# EAGLE schematic H0AR9 (EAGLE 9.6.2)

## Sheet 1 of 2
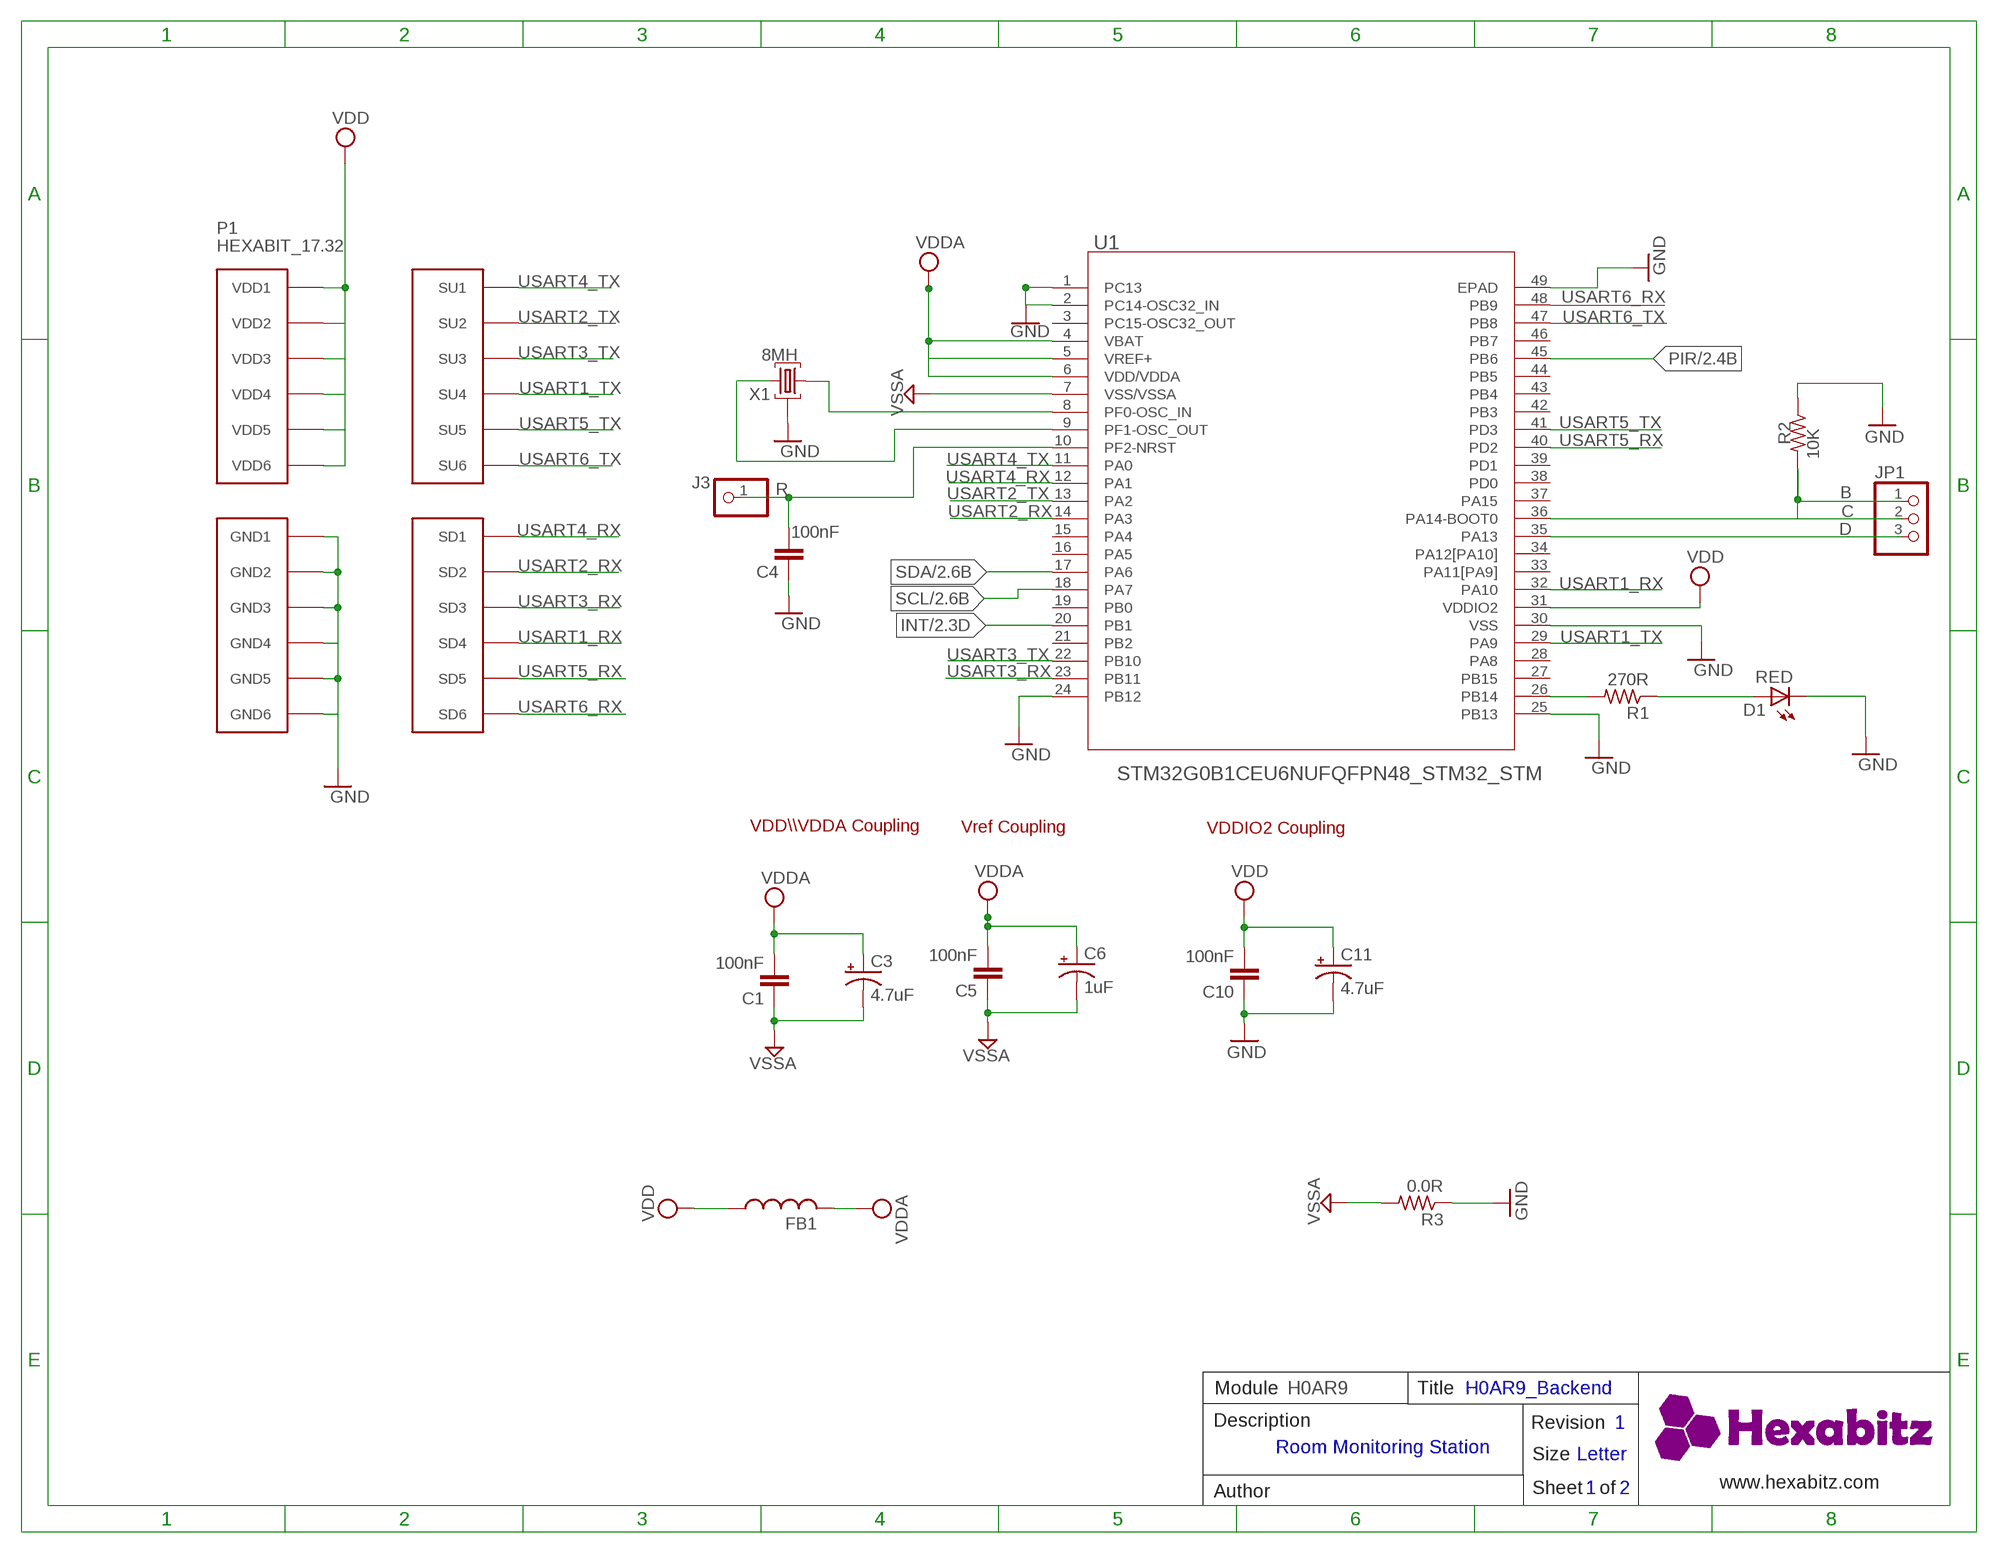
[diagram p0: schematic, sheet 1]

### Parts
C1  100nF  C-0603  [C-0603]
C3  4.7uF  C-0805-POL  [C-0805-POL]
C4  100nF  C-0603  [C-0603]
C5  100nF  C-0603  [C-0603]
C6  1uF  C-0805-POL  [C-0805-POL]
C10  100nF  C-0603  [C-0603]
C11  4.7uF  C-0805-POL  [C-0805-POL]
D1  RED  VLMS1300-GS08  [VLMS1300-GS08]
FB1  FB-TDK_MMZ1608Y300B  [FB-TDK_MMZ1608Y300B]
J3  PINHD-1X1  [1X01]
JP1  PINHD-1X3  [1X03]
P1  HEXABIT_17.32  [HEXABIT_17.32]
R1  270R  R-0603  [R-0603]
R2  10K  R-0603  [R-0603]
R3  0.0R  R-0603  [R-0603]
U1  STM32G0B1CEU6NUFQFPN48_STM32_STM  [UFQFPN48_STM32_STM]
X1  8MH  XTALL_CSTCE8M00G52  [XTALL_CSTCE8M00G52]

### Nets
C: JP1.1 JP1.2 R2.2 U1.36(PA14-BOOT0)
D: JP1.3 U1.35(PA13)
GND: C4.1 C10.1 C11.2(-) D1.C P1.PAD_PD7(GND1) P1.PAD_PD8(GND2) P1.PAD_PD9(GND3) P1.PAD_PD10(GND4) P1.PAD_PD11(GND5) P1.PAD_PD12(GND6) R2.1 R3.1 U1.1(PC13) U1.2(PC14-OSC32_IN) U1.24(PB12) U1.25(PB13) U1.30(VSS) U1.49(EPAD) X1.P$2 ; also sheet 2
GND1: C1.1 C3.2(-) C5.1 C6.2(-) R3.2 U1.7(VSS/VSSA) ; supply symbol labelled VSSA
INT: U1.20(PB1) ; also sheet 2
N$1: U1.8(PF0-OSC_IN) X1.P$3
N$2: U1.9(PF1-OSC_OUT) X1.P$1
N$17: R1.2 U1.26(PB14)
N$19: D1.A R1.1
PIR: U1.45(PB6) ; also sheet 2
R: C4.2 J3.1 U1.10(PF2-NRST)
SCL: U1.18(PA7) ; also sheet 2
SDA: U1.17(PA6) ; also sheet 2
USART1_RX: P1.PAD_PD4(SD4) U1.32(PA10)
USART1_TX: P1.PAD_PU4(SU4) U1.29(PA9)
USART2_RX: P1.PAD_PD2(SD2) U1.14(PA3)
USART2_TX: P1.PAD_PU2(SU2) U1.13(PA2)
USART3_RX: P1.PAD_PD3(SD3) U1.23(PB11)
USART3_TX: P1.PAD_PU3(SU3) U1.22(PB10)
USART4_RX: P1.PAD_PD1(SD1) U1.12(PA1)
USART4_TX: P1.PAD_PU1(SU1) U1.11(PA0)
USART5_RX: P1.PAD_PD5(SD5) U1.40(PD2)
USART5_TX: P1.PAD_PU5(SU5) U1.41(PD3)
USART6_RX: P1.PAD_PD6(SD6) U1.48(PB9)
USART6_TX: P1.PAD_PU6(SU6) U1.47(PB8)
VCC: C1.2 C3.1(+) C5.2 C6.1(+) FB1.2 U1.4(VBAT) U1.5(VREF+) U1.6(VDD/VDDA) ; supply symbol labelled VDDA
VDD: C10.2 C11.1(+) FB1.1 P1.PAD_PU7(VDD1) P1.PAD_PU8(VDD2) P1.PAD_PU9(VDD3) P1.PAD_PU10(VDD4) P1.PAD_PU11(VDD5) P1.PAD_PU12(VDD6) U1.31(VDDIO2) ; also sheet 2
Unconnected: U1.3(PC15-OSC32_OUT) U1.15(PA4) U1.16(PA5) U1.19(PB0) U1.21(PB2) U1.27(PB15) U1.28(PA8) U1.33(PA11[PA9]) U1.34(PA12[PA10]) U1.37(PA15) U1.38(PD0) U1.39(PD1) U1.42(PB3) U1.43(PB4) U1.44(PB5) U1.46(PB7)

### Notes on the sheet
- R | B
- VDD\\\VDDA Coupling | Vref Coupling | VDDIO2 Coupling
- Module | H0AR9 | Title | H0AR9_Backend
- Description | Revision | 1
- Room Monitoring Station
- Size | Letter
- www.hexabitz.com
- Author | Sheet   of | 1 | 2
- C:/Users/Admin/Desktop/logodraft.bmp

## Sheet 2 of 2
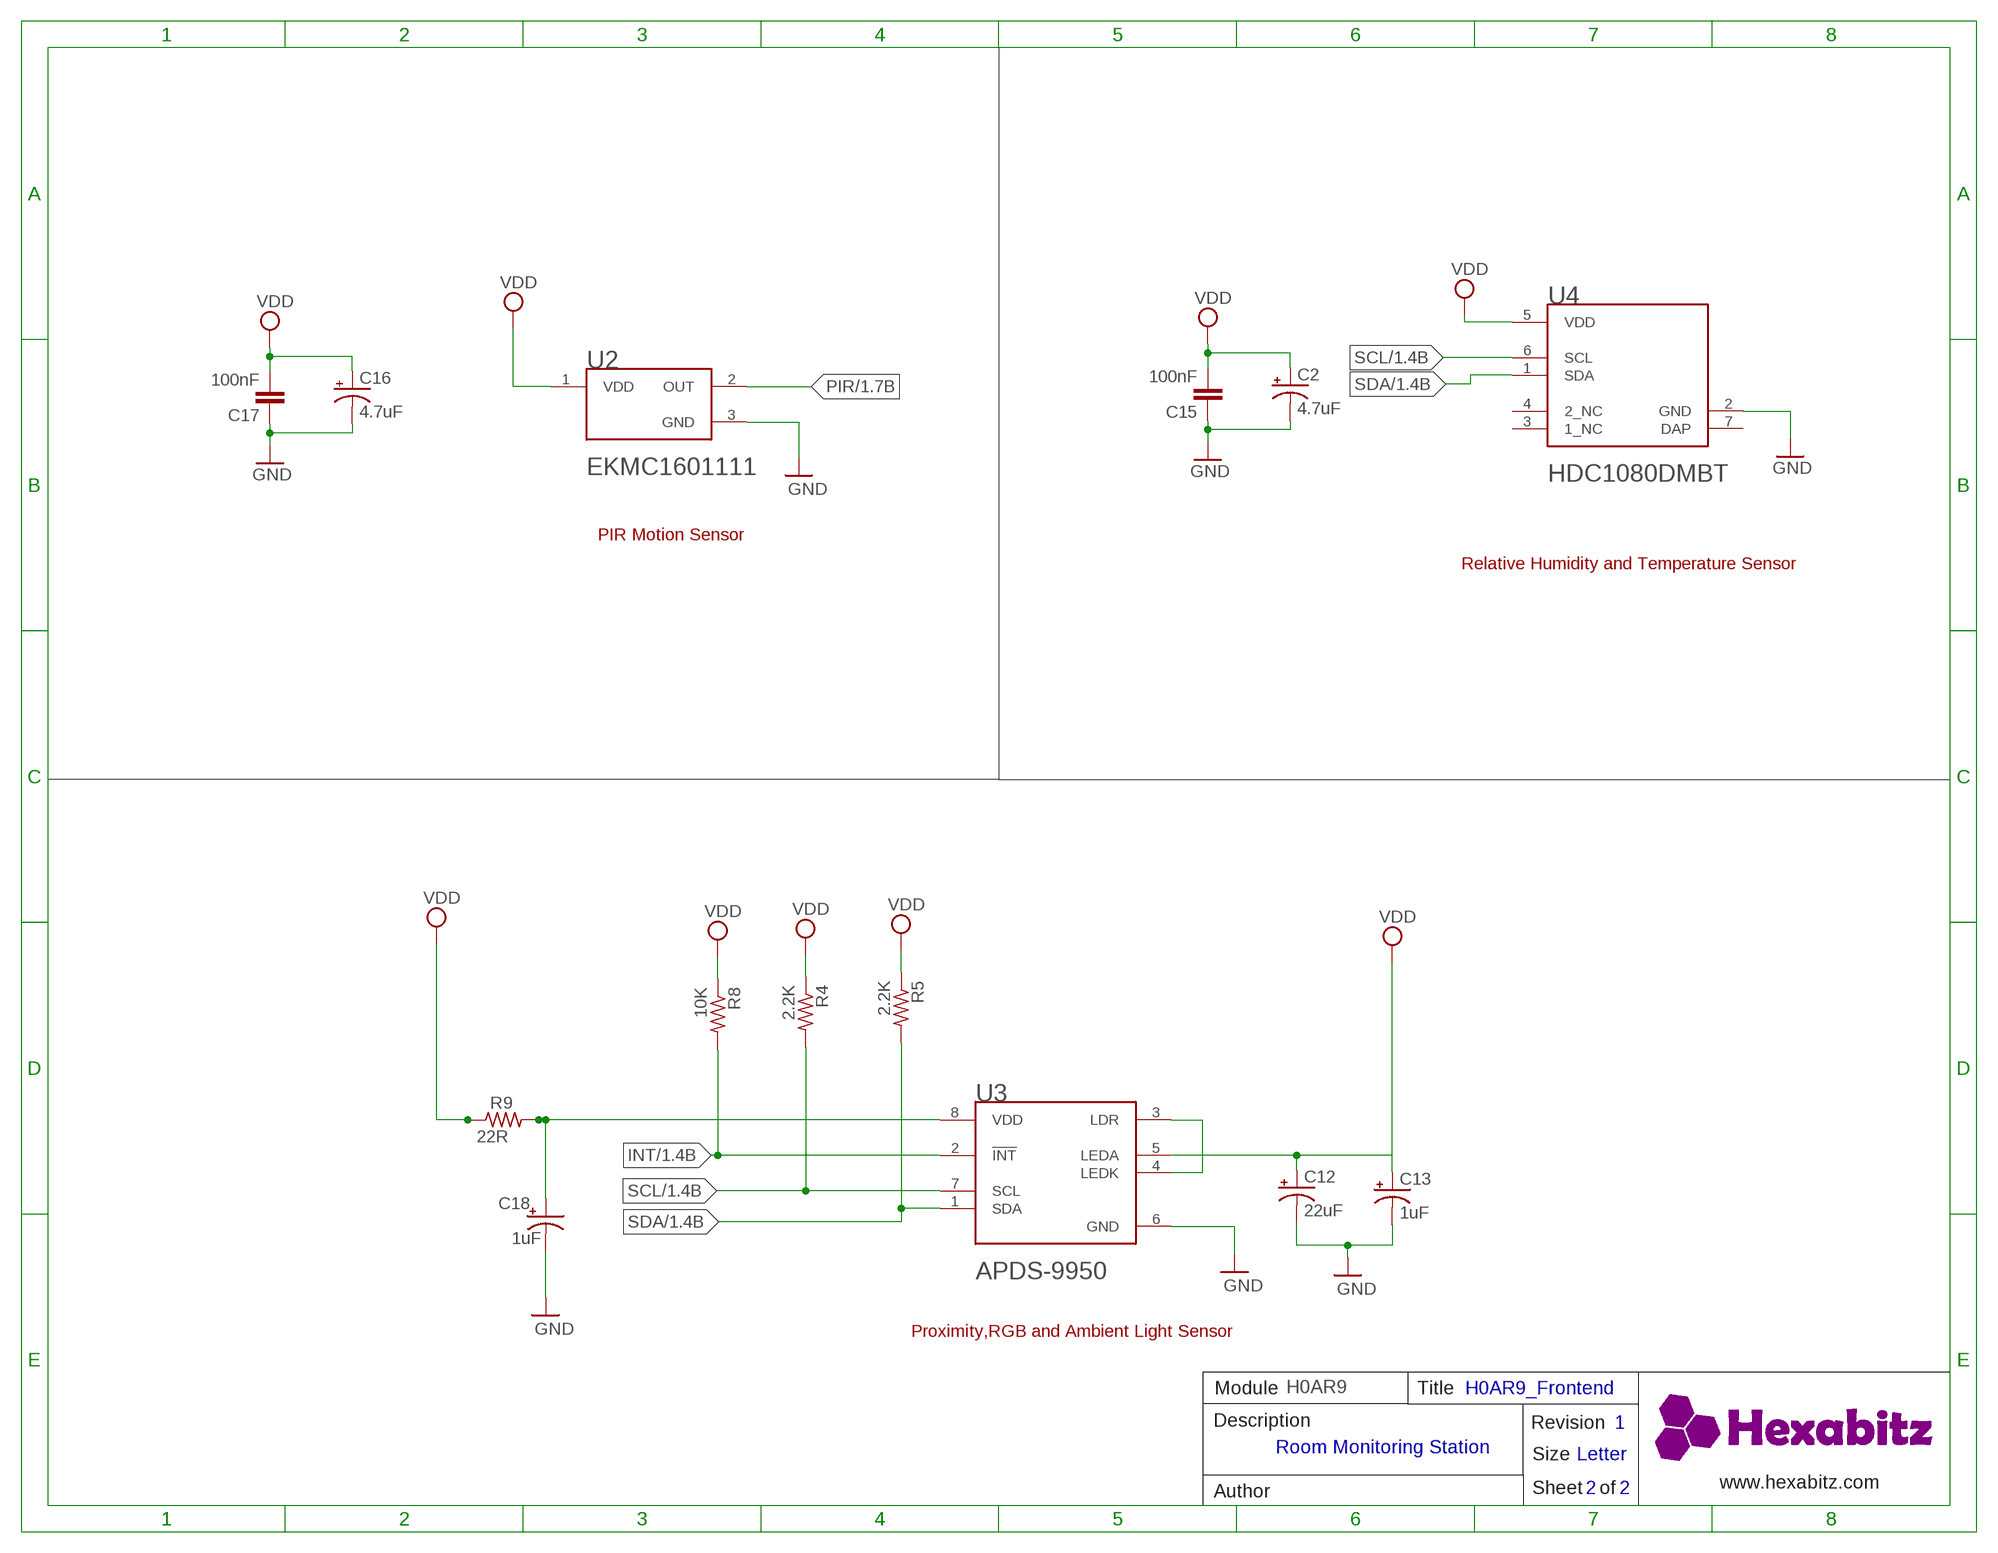
[diagram p1: schematic, sheet 2]

### Parts
C2  4.7uF  C-0805-POL  [C-0805-POL]
C12  22uF  C-0805-POL  [C-0805-POL]
C13  1uF  C-0805-POL  [C-0805-POL]
C15  100nF  C-0603  [C-0603]
C16  4.7uF  C-0805-POL  [C-0805-POL]
C17  100nF  C-0603  [C-0603]
C18  1uF  C-0805-POL  [C-0805-POL]
R4  2.2K  R-0603  [R-0603]
R5  2.2K  R-0603  [R-0603]
R8  10K  R-0603  [R-0603]
R9  22R  R-US_R1210  [R1210]
U2  PANASONIC_EKMC1601111PANASONIC_EKMC1601111_0_0  [PANASONIC_EKMC1601111_0]
U3  BROADCOM_APDS-9950BROADCOM_APDS-9950_0_0  BROADCOM_APDS-9960BROADCOM_APDS-9960_0_0  [BROADCOM_APDS-9960_0]
U4  TEXAS_INSTRUMENTS_HDC1080DMBT1TEXAS_INSTRUMENTS_HDC1080DMBT_0_1  [TEXAS_INSTRUMENTS_HDC1080DMBT_1]

### Nets
GND: C2.2(-) C12.2(-) C13.2(-) C15.1 C16.2(-) C17.1 C18.2(-) U2.3(GND) U3.6(GND) U4.2(GND) ; also sheet 1
INT: R8.2 U3.2(!INT!) ; also sheet 1
N$3: U3.3(LDR) U3.4(LEDK)
N$5: C18.1(+) R9.2 U3.8(VDD)
PIR: U2.2(OUT) ; also sheet 1
SCL: R4.2 U3.7(SCL) U4.6(SCL) ; also sheet 1
SDA: R5.2 U3.1(SDA) U4.1(SDA) ; also sheet 1
VDD: C2.1(+) C12.1(+) C13.1(+) C15.2 C16.1(+) C17.2 R4.1 R5.1 R8.1 R9.1 U2.1(VDD) U3.5(LEDA) U4.5(VDD) ; also sheet 1
Unconnected: U4.3(1_NC) U4.4(2_NC)

### Notes on the sheet
- PIR Motion Sensor
- Relative Humidity and Temperature Sensor
- Proximity,RGB and Ambient Light Sensor
- Module | H0AR9 | Title | H0AR9_Frontend
- Description | Revision | 1
- Room Monitoring Station
- Size | Letter
- www.hexabitz.com
- Author | Sheet   of | 2 | 2

## Power pins joined to a net without a drawn wire
DAP: U4.7(DAP)

## Library data of the parts
C1 C4 C5 C10 C15 C17 = HEXABITZ_RCLS:C-0603: CAP CER 10% X7R 0603; CAPACITANCE: 100nF; MFN: AVX CORPORATION; MPN: '0603YC104K4T2A; OCTOPART_URL: 'https://octopart.com/0603yc104k4t2a-avx+interconnect+%2F+elco-8120651; TOLERANCE: 10%; VOLTAGE_RATING: 16.0 V
C2 C3 C16 = HEXABITZ_RCLS:C-0805-POL: Cap Tant Solid SMD 2012; CAPACITANCE: 4.7uF; MFN: Panasonic; MPN: 10TPU4R7MSI; OCTOPART_URL: https://octopart.com/10tpu4r7msi-panasonic-29487748; TOLERANCE: 20%; VOLTAGE_RATING: 10.0 V
C6 C13 C18 = HEXABITZ_RCLS:C-0805-POL: Cap Tant Solid SMD 2012; CAPACITANCE: 1uF; MFN: 'YAGEO [VA]; MPN: 'CC0805KKX7R7BB105; OCTOPART_URL: https://octopart.com/cc0805kkx7r7bb105-yageo-8376555?r=sp; TOLERANCE: 20%; VOLTAGE_RATING: 10.0 V
C11 = HEXABITZ_RCLS:C-0805-POL: Cap Tant Solid SMD 2012; CAPACITANCE: 1.00uF; MFN: 'Panasonic; MPN: '10TPU4R7MSI; OCTOPART_URL: 'https://octopart.com/10tpu4r7msi-panasonic-29487748?r=sp; TOLERANCE: 10%; VOLTAGE_RATING: 16.0 V
C12 = HEXABITZ_RCLS:C-0805-POL: Cap Tant Solid SMD 2012; CAPACITANCE: 22uF; MFN: Kemet; MPN: T491B226K01AT; OCTOPART_URL: https://octopart.com/t491b226k016at-kemet-96457?r=sp; TOLERANCE: 20%; VOLTAGE_RATING: 10.0 V
D1 = HEXABITZ_USER_INTERFACE_PARTS:VLMS1300-GS08: Red 0603 130° Clear 54 mcd 2 V Surface Mount ChipLED ; Octopart Url : http://octopart.com/vlms1300-gs08-vishay-21709201; MFN: Vishay; MPN: VLMS1300-GS08; OCTOPART_URL: https://octopart.com/vlms1300-gs08-vishay-21709201?r=sp&s=0nXJNjGsSbWwqfqWlZv0EA
FB1 = HEXABITZ_RCLS:FB-TDK_MMZ1608Y300B: Ferrite Beads Multi-Layer 30Ohm 25% 100MHz 1.5A 50mOhm DCR 0603; MFN: TDK; MPN: MMZ1608Y300BTA00; OCTOPART_URL: https://octopart.com/mmz1608y300bta00-tdk-7906990?r=sp
J3 = HEXABITZ_USER_INTERFACE_PARTS:PINHD-1X1: PIN HEADER; MFN: TE Connectivity; MPN: 87227-1; OCTOPART_URL: https://octopart.com/87227-1-te+connectivity-39512052?r=sp
JP1 = pinhead:PINHD-1X3: PIN HEADER
P1 = hexabitz_connectors:HEXABIT_?: Hexabitz Hexagon Module Connector Hexagon side length = 28.87mm.
R1 = HEXABITZ_RCLS:R-0603: Thick Film Resistors - SMD 0603; MFN: 'Panasonic; MPN: 'ERJ-3GEYJ271V; OCTOPART_URL: https://octopart.com/erj-3geyj271v-panasonic-55560546?r=sp; RESISTANCE: 270R
R2 = HEXABITZ_RCLS:R-0603: Thick Film Resistors - SMD 0603; MFN: Vishay; MPN: '060300J0103T5E; OCTOPART_URL: https://octopart.com/search?q=060300J0103T5E&currency=USD&specs=0; RESISTANCE: 10K
R3 = HEXABITZ_RCLS:R-0603: Thick Film Resistors - SMD 0603; MFN: YAGEO [VR]; MPN: RC0603JR-070RL; OCTOPART_URL: https://octopart.com/rc0603jr-070rl-yageo-1241539?r=sp; RESISTANCE: 0R
R4 R5 = HEXABITZ_RCLS:R-0603: Thick Film Resistors - SMD 0603; MFN: Yageo; MPN: RC0603FR-072K2L; OCTOPART_URL: https://octopart.com/rc0603fr-072k2l-yageo-1214512?r=sp; RESISTANCE: 2.2K Ohm; TOLERANCE: 5%
R8 = HEXABITZ_RCLS:R-0603: Thick Film Resistors - SMD 0603; MFN: Vishay; MPN: '060300J0103T5E; OCTOPART_URL: https://octopart.com/search?q=060300J0103T5E&currency=USD&specs=0; RESISTANCE: 10K Ohm; TOLERANCE: 5%
R9 = rcl:R-US_: RESISTOR, American symbol; SPICEPREFIX: R
U1 = HEXABITZ_ICs:STM32G0B1CEU6N; COPYRIGHT: Copyright (C) 2022 Ultra Librarian. All rights reserved.; MFN: STMicroelectronics; MPN: STM32G0B1CEU6N; OCTOPART_URL: https://octopart.com/stm32g0b1ceu6n-stmicroelectronics-116364672?r=sp
U2 = HEXABITZ_ICs:PANASONIC_EKMC1601111: Board Mount Motion & Position Sensors Digital 170uA 5m White; CENTROID_NOT_SPECIFIED: No; DATASHEET: https://upverter.com/datasheet/08257041b259bfb866b24d8a71eb3fd58ddfaa35.pdf; DIGIKEY_DESCRIPTION: IC SENSOR MOTION PIR 170UA DGTL WHT; DIGIKEY_PART_NUMBER: 255-3074-ND; IMPORTED_FROM: octopart; LEAD_FREE: yes; MF: Panasonic; MOUSER_PART_NUMBER: 769-EKMC1601111; MPN: EKMC1601111; NUM_PINS: 3; OCTOPART_PART_NUMBER: 95495d6204bb4a8e; PACKAGE: PTH_SENSOR_11MM_DIA; PREFIX: U; ROHS: yes; SENSOR_TYPE: Motion, Pyroelectric, PIR (Passive Infrared); TEMPERATURE_RANGE_HIGH: +60 °C; TEMPERATURE_RANGE_LOW: -20 °C; VOLTAGE: 3 V ~ 6 V
U3 = HEXABITZ_ICs:BROADCOM_APDS-9960: Optical Sensor Ambient 560nm I²C 8-SMD Module; AMBIENT_TEMPERATURE_RANGE_HIGH: +85°C; AMBIENT_TEMPERATURE_RANGE_LOW: -30°C; AUTOMOTIVE: No; CENTROID_NOT_SPECIFIED: No; DATASHEET: http://docs.avagotech.com/docs/AV02-4191EN; DEVICE_CLASS_L1: Sensors; DEVICE_CLASS_L2: Optical Sensors; DEVICE_CLASS_L3: unset; DIGIKEY_DESCRIPTION: SENSOR OPT 560NM AMBIENT MODULE; DIGIKEY_PART_NUMBER: 516-3480-1-ND; FOOTPRINT_VARIANT_NAME_0: Recommended_Land_Pattern; HEIGHT: 1.45mm; LEAD_FREE: Yes; MAX_SUPPLY_VOLTAGE: 3.6V; MF: Broadcom; MFG_PACKAGE_IDENT: 0; MFG_PACKAGE_IDENT_DATE: 0; MFG_PACKAGE_IDENT_REV: 0; MIN_SUPPLY_VOLTAGE: 2.4V; MOUSER_PART_NUMBER: 630-APDS-9960; MPN: APDS-9960; OPERATING_SUPPLY_CURRENT: 38-790uA; PACKAGE: SMD8; PIN_0_0_5_INSIDE_EDGE: clock; PREFIX: U; ROHS: Yes; SENSOR_OUTPUT: I2C; TEMPERATURE_RANGE_HIGH: +85°C; TEMPERATURE_RANGE_LOW: -30°C; VERIFICATION_VERSION: 0.0.0.3
U4 = HEXABITZ_ICs:TEXAS_INSTRUMENTS_HDC1080DMBT1: HDC1080 Low Power, High Accuracy Digital Humidity Sensor with Temperature Sensor; ACCURACY: 2%; AMBIENT_TEMPERATURE_RANGE_HIGH: +70°C; AMBIENT_TEMPERATURE_RANGE_LOW: -20°C; AUTOMOTIVE: No; CENTROID_NOT_SPECIFIED: No; DATASHEET: https://www.ti.com/lit/ds/symlink/hdc1080.pdf?ts=1599702051529&ref_url=https%253A%252F%252Fwww.ti.com%252Fstore%252Fti%252Fen%252Fp%252Fproduct%252F%253Fp%253DHDC1080DMBT; DEVICE_CLASS_L1: Sensors; DEVICE_CLASS_L2: Temperature and Humidity Sensors; DEVICE_CLASS_L3: unset; DIGIKEY_DESCRIPTION: SENSOR HUMI/TEMP 3.3V I2C 2% SMD; DIGIKEY_PART_NUMBER: 296-43864-1-ND; FOOTPRINT_PARAMETERS_1: {"fp_type":"DFN","params":{"N":{"nom":6,"long name":"Number of leads","min":null,"max":null,"short name":"N","type":"count"},"A":{"nom":false,"long name":"Height","min":false,"max":800000,"short name":"A","type":"measurement"},"A1":{"nom":25000,"long name":"Package clearance","min":0,"max":50000,"short name":"A1","type":"measurement"},"A2":{"nom":false,"long name":"Package height","min":false,"max":800000,"short name":"A2","type":"measurement"},"D":{"nom":3000000,"long name":"Package length","min":2900000,"max":3100000,"short name":"D","type":"measurement"},"E":{"nom":3000000,"long name":"Package width","min":2900000,"max":3100000,"short name":"E","type":"measurement"},"B":{"nom":400000,"long name":"Lead width","min":350000,"max":450000,"short name":"B","type":"measurement"},"C":{"nom":200000,"long name":"Lead thickness","min":null,"max":null,"short name":"C","type":"measurement"},"L":{"nom":400000,"long name":"Lead foot length","min":300000,"max":500000,"short name":"L","type":"measurement"},"e":{"nom":1000000,"long name":"Lead pitch","min":null,"max":null,"short name":"e","type":"measurement"},"HT":{"default":"Yes","long name":"Thermal pad","type":"multichoiceparent","short name":"HT","children":["D2","E2","PC"]},"offset x":{"nom":0,"long name":"X Center offset","min":null,"max":null,"short name":"offset x","type":"measurement"},"offset y":{"nom":0,"long name":"Y Center offset","min":null,"max":null,"short name":"offset y","type":"measurement"},"LS":{"default":"Rounded rectangle","long name":"Land shape","type":"multichoice","short name":"LS"},"LS1":{"default":"Rectangle","long name":"Land shape (Pin 1)","type":"multichoice","short name":"LS1"},"solder toe":{"nom":400000,"long name":"Solder fillet (toe)","min":null,"max":null,"short name":"solder toe","type":"fixedmeasurement"},"solder heel":{"nom":0,"long name":"Solder fillet (heel)","min":null,"max":null,"short name":"solder heel","type":"fixedmeasurement"},"solder side":{"nom":-40000,"long name":"Solder fillet (side)","min":null,"max":null,"short name":"solder side","type":"fixedmeasurement"},"courtyard":{"nom":500000,"long name":"Courtyard","min":null,"max":null,"short name":"courtyard","type":"fixedmeasurement"},"SF":{"default":"A","long name":"Packing level","type":"multichoiceparent","short name":"SF","help":"http://support.upverter.com/customer/portal/articles/978783-what-is-a-footprint-packing-level","children":["solder toe","solder heel","solder side","courtyard"]},"D2":{"nom":2400000,"long name":"Thermal pad length","min":2300000,"max":2500000,"short name":"D2","type":"measurement"},"E2":{"nom":1500000,"long name":"Thermal pad width","min":1400000,"max":1600000,"short name":"E2","type":"measurement"},"PC":{"long name":"Paste coverage (%)","type":"percentage","short name":"PC","value":40}}}; FOOTPRINT_PARAMETERS_2: {"fp_type":"DFN","params":{"N":{"nom":6,"long name":"Number of leads","min":null,"max":null,"short name":"N","type":"count"},"A":{"nom":false,"long name":"Height","min":false,"max":800000,"short name":"A","type":"measurement"},"A1":{"nom":25000,"long name":"Package clearance","min":0,"max":50000,"short name":"A1","type":"measurement"},"A2":{"nom":false,"long name":"Package height","min":false,"max":800000,"short name":"A2","type":"measurement"},"D":{"nom":3000000,"long name":"Package length","min":2900000,"max":3100000,"short name":"D","type":"measurement"},"E":{"nom":3000000,"long name":"Package width","min":2900000,"max":3100000,"short name":"E","type":"measurement"},"B":{"nom":400000,"long name":"Lead width","min":350000,"max":450000,"short name":"B","type":"measurement"},"C":{"nom":200000,"long name":"Lead thickness","min":null,"max":null,"short name":"C","type":"measurement"},"L":{"nom":400000,"long name":"Lead foot length","min":300000,"max":500000,"short name":"L","type":"measurement"},"e":{"nom":1000000,"long name":"Lead pitch","min":null,"max":null,"short name":"e","type":"measurement"},"D2":{"nom":2400000,"long name":"Thermal pad length","min":2300000,"max":2500000,"short name":"D2","type":"measurement"},"E2":{"nom":1500000,"long name":"Thermal pad width","min":1400000,"max":1600000,"short name":"E2","type":"measurement"},"PC":{"long name":"Paste coverage (%)","type":"percentage","short name":"PC","value":40},"HT":{"default":"Yes","long name":"Thermal pad","type":"multichoiceparent","short name":"HT","children":["D2","E2","PC"]},"offset x":{"nom":0,"long name":"X Center offset","min":null,"max":null,"short name":"offset x","type":"measurement"},"offset y":{"nom":0,"long name":"Y Center offset","min":null,"max":null,"short name":"offset y","type":"measurement"},"LS":{"default":"Rounded rectangle","long name":"Land shape","type":"multichoice","short name":"LS"},"LS1":{"default":"Rectangle","long name":"Land shape (Pin 1)","type":"multichoice","short name":"LS1"},"solder toe":{"nom":300000,"long name":"Solder fillet (toe)","min":null,"max":null,"short name":"solder toe","type":"fixedmeasurement"},"solder heel":{"nom":0,"long name":"Solder fillet (heel)","min":null,"max":null,"short name":"solder heel","type":"fixedmeasurement"},"solder side":{"nom":-40000,"long name":"Solder fillet (side)","min":null,"max":null,"short name":"solder side","type":"fixedmeasurement"},"courtyard":{"nom":250000,"long name":"Courtyard","min":null,"max":null,"short name":"courtyard","type":"fixedmeasurement"},"SF":{"default":"B","long name":"Packing level","type":"multichoiceparent","short name":"SF","help":"http://support.upverter.com/customer/portal/articles/978783-what-is-a-footprint-packing-level","children":["solder toe","solder heel","solder side","courtyard"]}}}; FOOTPRINT_PARAMETERS_3: {"fp_type":"DFN","params":{"N":{"nom":6,"long name":"Number of leads","min":null,"max":null,"short name":"N","type":"count"},"A":{"nom":false,"long name":"Height","min":false,"max":800000,"short name":"A","type":"measurement"},"A1":{"nom":25000,"long name":"Package clearance","min":0,"max":50000,"short name":"A1","type":"measurement"},"A2":{"nom":false,"long name":"Package height","min":false,"max":800000,"short name":"A2","type":"measurement"},"D":{"nom":3000000,"long name":"Package length","min":2900000,"max":3100000,"short name":"D","type":"measurement"},"E":{"nom":3000000,"long name":"Package width","min":2900000,"max":3100000,"short name":"E","type":"measurement"},"B":{"nom":400000,"long name":"Lead width","min":350000,"max":450000,"short name":"B","type":"measurement"},"C":{"nom":200000,"long name":"Lead thickness","min":null,"max":null,"short name":"C","type":"measurement"},"L":{"nom":400000,"long name":"Lead foot length","min":300000,"max":500000,"short name":"L","type":"measurement"},"e":{"nom":1000000,"long name":"Lead pitch","min":null,"max":null,"short name":"e","type":"measurement"},"D2":{"nom":2400000,"long name":"Thermal pad length","min":2300000,"max":2500000,"short name":"D2","type":"measurement"},"E2":{"nom":1500000,"long name":"Thermal pad width","min":1400000,"max":1600000,"short name":"E2","type":"measurement"},"PC":{"long name":"Paste coverage (%)","type":"percentage","short name":"PC","value":40},"HT":{"default":"Yes","long name":"Thermal pad","type":"multichoiceparent","short name":"HT","children":["D2","E2","PC"]},"offset x":{"nom":0,"long name":"X Center offset","min":null,"max":null,"short name":"offset x","type":"measurement"},"offset y":{"nom":0,"long name":"Y Center offset","min":null,"max":null,"short name":"offset y","type":"measurement"},"LS":{"default":"Rounded rectangle","long name":"Land shape","type":"multichoice","short name":"LS"},"LS1":{"default":"Rectangle","long name":"Land shape (Pin 1)","type":"multichoice","short name":"LS1"},"solder toe":{"nom":200000,"long name":"Solder fillet (toe)","min":null,"max":null,"short name":"solder toe","type":"fixedmeasurement"},"solder heel":{"nom":0,"long name":"Solder fillet (heel)","min":null,"max":null,"short name":"solder heel","type":"fixedmeasurement"},"solder side":{"nom":-40000,"long name":"Solder fillet (side)","min":null,"max":null,"short name":"solder side","type":"fixedmeasurement"},"courtyard":{"nom":100000,"long name":"Courtyard","min":null,"max":null,"short name":"courtyard","type":"fixedmeasurement"},"SF":{"default":"C","long name":"Packing level","type":"multichoiceparent","short name":"SF","help":"http://support.upverter.com/customer/portal/articles/978783-what-is-a-footprint-packing-level","children":["solder toe","solder heel","solder side","courtyard"]}}}; FOOTPRINT_VARIANT_NAME_0: Recommended_Land_Pattern; FOOTPRINT_VARIANT_NAME_1: IPC_A; FOOTPRINT_VARIANT_NAME_2: IPC_B; FOOTPRINT_VARIANT_NAME_3: IPC_C; HEIGHT: 0.8mm; INTERFACE: I2C; LEAD_FREE: Yes; MAX_SUPPLY_VOLTAGE: 5.5V; MF: Texas Instruments; MFG_PACKAGE_IDENT: DMB0006A; MFG_PACKAGE_IDENT_COMPONENT_ID: ec7dcad3e24eabe8; MFG_PACKAGE_IDENT_DATE: 0; MFG_PACKAGE_IDENT_REV: 0; MIN_SUPPLY_VOLTAGE: 2.7V; MOUSER_PART_NUMBER: 595-HDC1080DMBT; MPN: HDC1080DMBT; PACKAGE: WSON6; PIN_0_0_2_INSIDE_EDGE: clock; PREFIX: U; RESOLUTION: 14bits; ROHS: Yes; SENSOR_OUTPUT: I2C; STANDOFF_HEIGHT: 0mm; TEMPERATURE_RANGE_HIGH: +85°C; TEMPERATURE_RANGE_LOW: -20°C; VERIFICATION_VERSION: 0.0.0.3; VOLTAGE: 5.5V
X1 = HEXABITZ_OTHER_PARTS:XTALL_CSTCE8M00G52: MURATA CSTCE8M00G52-R0 RESONATOR, SMD, 8MHZ ; Octopart Url : https://octopart.com/cstce8m00g52-r0-murata-7145559; MFN: Murata; MPN: CSTNE8M00G550000R0; OCTOPART_URL: https://octopart.com/cstne8m00g550000r0-murata-91406934?r=sp